# EAGLE design m220new (EAGLE 4.11)
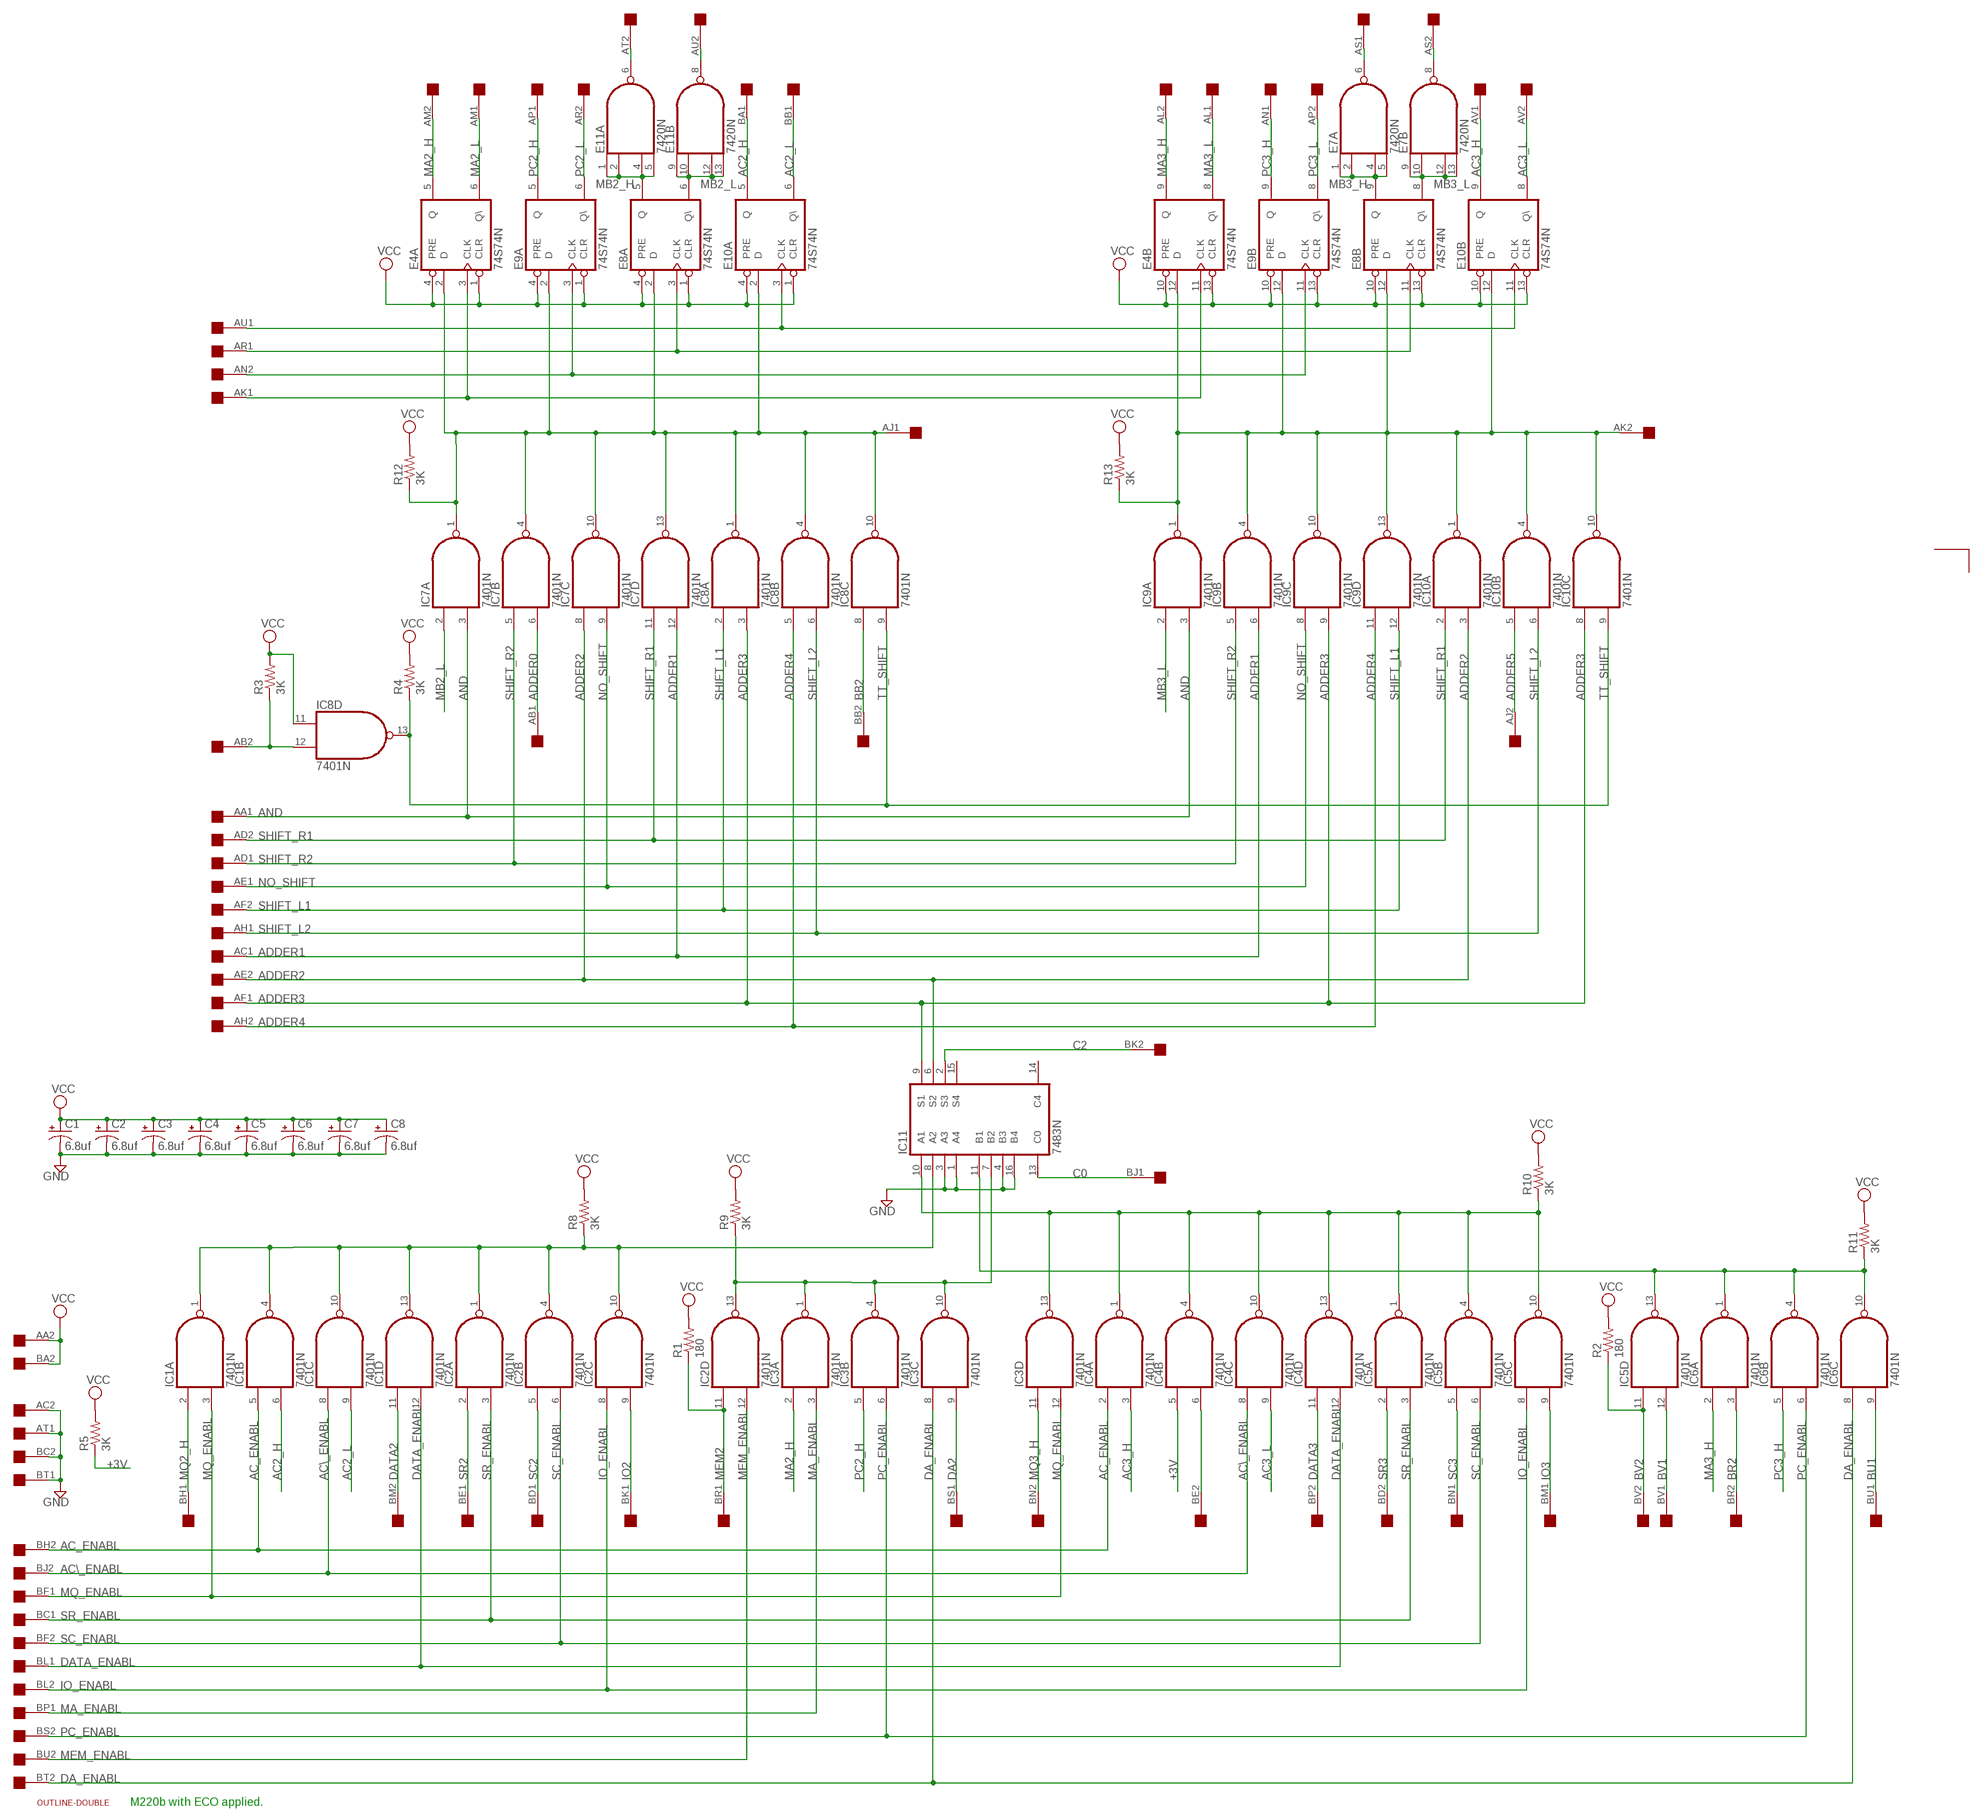
[diagram p0: schematic, sheet 1]

## Parts
C1  6.8uf  CPOL-USE15-5AXIAL  [E15-5]
C2  6.8uf  CPOL-USE15-5AXIAL  [E15-5]
C3  6.8uf  CPOL-USE15-5AXIAL  [E15-5]
C4  6.8uf  CPOL-USE15-5AXIAL  [E15-5]
C5  6.8uf  CPOL-USE15-5AXIAL  [E15-5]
C6  6.8uf  CPOL-USE15-5AXIAL  [E15-5]
C7  6.8uf  CPOL-USE15-5AXIAL  [E15-5]
C8  6.8uf  CPOL-USE15-5AXIAL  [E15-5]
E4  74S74N  [DIL14]
E7  7420N  74S20N  [DIL14]
E8  74S74N  [DIL14]
E9  74S74N  [DIL14]
E10  74S74N  [DIL14]
E11  7420N  74S20N  [DIL14]
IC1  7401N  [DIL14]
IC2  7401N  [DIL14]
IC3  7401N  [DIL14]
IC4  7401N  [DIL14]
IC5  7401N  [DIL14]
IC6  7401N  [DIL14]
IC7  7401N  [DIL14]
IC8  7401N  [DIL14]
IC9  7401N  [DIL14]
IC10  7401N  [DIL14]
IC11  7483N  [DIL16]
R1  180  R-US_0207/10  [0207/10]
R2  180  R-US_0207/10  [0207/10]
R3  3K  R-US_0207/10  [0207/10]
R4  3K  R-US_0207/10  [0207/10]
R5  3K  R-US_0207/10  [0207/10]
R8  3K  R-US_0207/10  [0207/10]
R9  3K  R-US_0207/10  [0207/10]
R10  3K  R-US_0207/10  [0207/10]
R11  3K  R-US_0207/10  [0207/10]
R12  3K  R-US_0207/10  [0207/10]
R13  3K  R-US_0207/10  [0207/10]
U$1  DOUBLE  [EDGE-CON4]
U$2  OUTLINE-DOUBLE  [DOUBLE]

## Nets
+3V: IC4.5(B:I0) R5.1
AC2_H: E10.5(A:Q) IC1.6(B:I1) U$1.BA1
AC2_L: E10.6(A:Q\) IC1.9(C:I1) U$1.BB1
AC3_H: E10.9(B:Q) IC4.3(A:I1) U$1.AV1
AC3_L: E10.8(B:Q\) IC4.9(C:I1) U$1.AV2
AC\_ENABL: IC1.8(C:I0) IC4.8(C:I0) U$1.BJ2
AC_ENABL: IC1.5(B:I0) IC4.2(A:I0) U$1.BH2
ADDER0: IC7.6(B:I1) U$1.AB1
ADDER1: IC7.12(D:I1) IC9.6(B:I1) U$1.AC1
ADDER2: IC7.8(C:I0) IC10.3(A:I1) IC11.6(S2) U$1.AE2
ADDER3: IC8.3(A:I1) IC9.9(C:I1) IC10.8(C:I0) IC11.9(S1) U$1.AF1
ADDER4: IC8.5(B:I0) IC9.11(D:I0) U$1.AH2
ADDER5: IC10.5(B:I0) U$1.AJ2
AJ1: E4.2(A:D) E8.2(A:D) E9.2(A:D) E10.2(A:D) IC7.1(A:O) IC7.4(B:O) IC7.10(C:O) IC7.13(D:O) IC8.1(A:O) IC8.4(B:O) IC8.10(C:O) R12.1 U$1.AJ1
AK1: E4.3(A:CLK) E4.11(B:CLK) U$1.AK1
AK2: E4.12(B:D) E8.12(B:D) E9.12(B:D) E10.12(B:D) IC9.1(A:O) IC9.4(B:O) IC9.10(C:O) IC9.13(D:O) IC10.1(A:O) IC10.4(B:O) IC10.10(C:O) R13.1 U$1.AK2
AN2: E9.3(A:CLK) E9.11(B:CLK) U$1.AN2
AND: IC7.3(A:I1) IC9.3(A:I1) U$1.AA1
AR1: E8.3(A:CLK) E8.11(B:CLK) U$1.AR1
AS1: E7.6(A:O) U$1.AS1
AS2: E7.8(B:O) U$1.AS2
AT2: E11.6(A:O) U$1.AT2
AU1: E10.3(A:CLK) E10.11(B:CLK) U$1.AU1
AU2: E11.8(B:O) U$1.AU2
BB2: IC8.8(C:I0) U$1.BB2
BE2: IC4.6(B:I1) U$1.BE2
BR2: IC6.3(A:I1) U$1.BR2
BU1: IC6.9(C:I1) U$1.BU1
BV1: IC5.12(D:I1) U$1.BV1
BV2: IC5.11(D:I0) R2.1 U$1.BV2
C0: IC11.13(C0) U$1.BJ1
C2: IC11.2(S3) U$1.BK2
DA2: IC3.9(C:I1) U$1.BS1
DA_ENABL: IC3.8(C:I0) IC6.8(C:I0) U$1.BT2
DATA2: IC1.11(D:I0) U$1.BM2
DATA3: IC4.11(D:I0) U$1.BP2
DATA_ENABL: IC1.12(D:I1) IC4.12(D:I1) U$1.BL1
GND: C1.- C2.- C3.- C4.- C5.- C6.- C7.- C8.- IC11.1(A4) IC11.3(A3) IC11.4(B3) IC11.16(B4) U$1.AC2 U$1.AT1 U$1.BC2 U$1.BT1
IO2: IC2.9(C:I1) U$1.BK1
IO3: IC5.9(C:I1) U$1.BM1
IO_ENABL: IC2.8(C:I0) IC5.8(C:I0) U$1.BL2
MA2_H: E4.5(A:Q) IC3.2(A:I0) U$1.AM2
MA2_L: E4.6(A:Q\) U$1.AM1
MA3_H: E4.9(B:Q) IC6.2(A:I0) U$1.AL2
MA3_L: E4.8(B:Q\) U$1.AL1
MA_ENABL: IC3.3(A:I1) U$1.BP1
MB2_H: E8.5(A:Q) E11.1(A:I0) E11.2(A:I1) E11.4(A:I2) E11.5(A:I3)
MB2_L: E8.6(A:Q\) E11.9(B:I0) E11.10(B:I1) E11.12(B:I2) E11.13(B:I3) IC7.2(A:I0)
MB3_H: E7.1(A:I0) E7.2(A:I1) E7.4(A:I2) E7.5(A:I3) E8.9(B:Q)
MB3_L: E7.9(B:I0) E7.10(B:I1) E7.12(B:I2) E7.13(B:I3) E8.8(B:Q\) IC9.2(A:I0)
MEM2: IC2.11(D:I0) R1.1 U$1.BR1
MEM_ENABL: IC2.12(D:I1) U$1.BU2
MQ2_H: IC1.2(A:I0) U$1.BH1
MQ3_H: IC3.11(D:I0) U$1.BN2
MQ_ENABL: IC1.3(A:I1) IC3.12(D:I1) U$1.BF1
N$5: IC1.1(A:O) IC1.4(B:O) IC1.10(C:O) IC1.13(D:O) IC2.1(A:O) IC2.4(B:O) IC2.10(C:O) IC11.8(A2) R8.1
N$8: IC3.13(D:O) IC4.1(A:O) IC4.4(B:O) IC4.10(C:O) IC4.13(D:O) IC5.1(A:O) IC5.4(B:O) IC5.10(C:O) IC11.10(A1) R10.1
N$12: IC2.13(D:O) IC3.1(A:O) IC3.4(B:O) IC3.10(C:O) IC11.7(B2) R9.1
N$14: IC5.13(D:O) IC6.1(A:O) IC6.4(B:O) IC6.10(C:O) IC11.11(B1) R11.1
NO_SHIFT: IC7.9(C:I1) IC9.8(C:I0) U$1.AE1
PC2_H: E9.5(A:Q) IC3.5(B:I0) U$1.AP1
PC2_L: E9.6(A:Q\) U$1.AR2
PC3_H: E9.9(B:Q) IC6.5(B:I0) U$1.AN1
PC3_L: E9.8(B:Q\) U$1.AP2
PC_ENABL: IC3.6(B:I1) IC6.6(B:I1) U$1.BS2
SC2: IC2.5(B:I0) U$1.BD1
SC3: IC5.5(B:I0) U$1.BN1
SC_ENABL: IC2.6(B:I1) IC5.6(B:I1) U$1.BF2
SHIFT_L1: IC8.2(A:I0) IC9.12(D:I1) U$1.AF2
SHIFT_L2: IC8.6(B:I1) IC10.6(B:I1) U$1.AH1
SHIFT_R1: IC7.11(D:I0) IC10.2(A:I0) U$1.AD2
SHIFT_R2: IC7.5(B:I0) IC9.5(B:I0) U$1.AD1
SR2: IC2.2(A:I0) U$1.BE1
SR3: IC5.2(A:I0) U$1.BD2
SR_ENABL: IC2.3(A:I1) IC5.3(A:I1) U$1.BC1
TT_SHIFT: IC8.9(C:I1) IC8.13(D:O) IC10.9(C:I1) R4.1
TT_SHIFT\: IC8.12(D:I1) R3.1 U$1.AB2
VCC: C1.+ C2.+ C3.+ C4.+ C5.+ C6.+ C7.+ C8.+ E4.1(A:CLR) E4.4(A:PRE) E4.10(B:PRE) E4.13(B:CLR) E8.1(A:CLR) E8.4(A:PRE) E8.10(B:PRE) E8.13(B:CLR) E9.1(A:CLR) E9.4(A:PRE) E9.10(B:PRE) E9.13(B:CLR) E10.1(A:CLR) E10.4(A:PRE) E10.10(B:PRE) E10.13(B:CLR) IC8.11(D:I0) R1.2 R2.2 R3.2 R4.2 R5.2 R8.2 R9.2 R10.2 R11.2 R12.2 R13.2 U$1.AA2 U$1.BA2
Unconnected: IC6.11(D:I0) IC6.12(D:I1) IC6.13(D:O) IC10.11(D:I0) IC10.12(D:I1) IC10.13(D:O) IC11.14(C4) IC11.15(S4)

## Notes on the sheet
- M220b with ECO applied.

## Power pins joined to a net without a drawn wire
GND: E4.7(P:GND) E7.7(P:GND) E8.7(P:GND) E9.7(P:GND) E10.7(P:GND) E11.7(P:GND) IC1.7(P:GND) IC2.7(P:GND) IC3.7(P:GND) IC4.7(P:GND) IC5.7(P:GND) IC6.7(P:GND) IC7.7(P:GND) IC8.7(P:GND) IC9.7(P:GND) IC10.7(P:GND) IC11.12(GND)
VCC: E4.14(P:VCC) E7.14(P:VCC) E8.14(P:VCC) E9.14(P:VCC) E10.14(P:VCC) E11.14(P:VCC) IC1.14(P:VCC) IC2.14(P:VCC) IC3.14(P:VCC) IC4.14(P:VCC) IC5.14(P:VCC) IC6.14(P:VCC) IC7.14(P:VCC) IC8.14(P:VCC) IC9.14(P:VCC) IC10.14(P:VCC) IC11.5(VCC)

## Library data of the parts
C1-C8 = rcl:CPOL-US: POLARIZED CAPACITOR, American symbol
E4 E8-E10 = 74xx-us:74*74: Dual D type positive edge triggered FLIP FLOP, preset and clear
E7 E11 = 74xx-jameco:74*20: Dual 4-input NAND gate
IC1-IC10 = 74xx-jameco:74*01: Quad 2-input NAND gate, open collector
IC11 = 74xx-jameco:74*83: 4-bit binary full ADDER, fast carry
R1-R5 R8-R13 = rcl:R-US_: RESISTOR, American symbol
U$1 = dec-con:DOUBLE: Double-Height DEC board
U$2 = dec-con:OUTLINE-*: Board outlines for DEC boards.

## Board
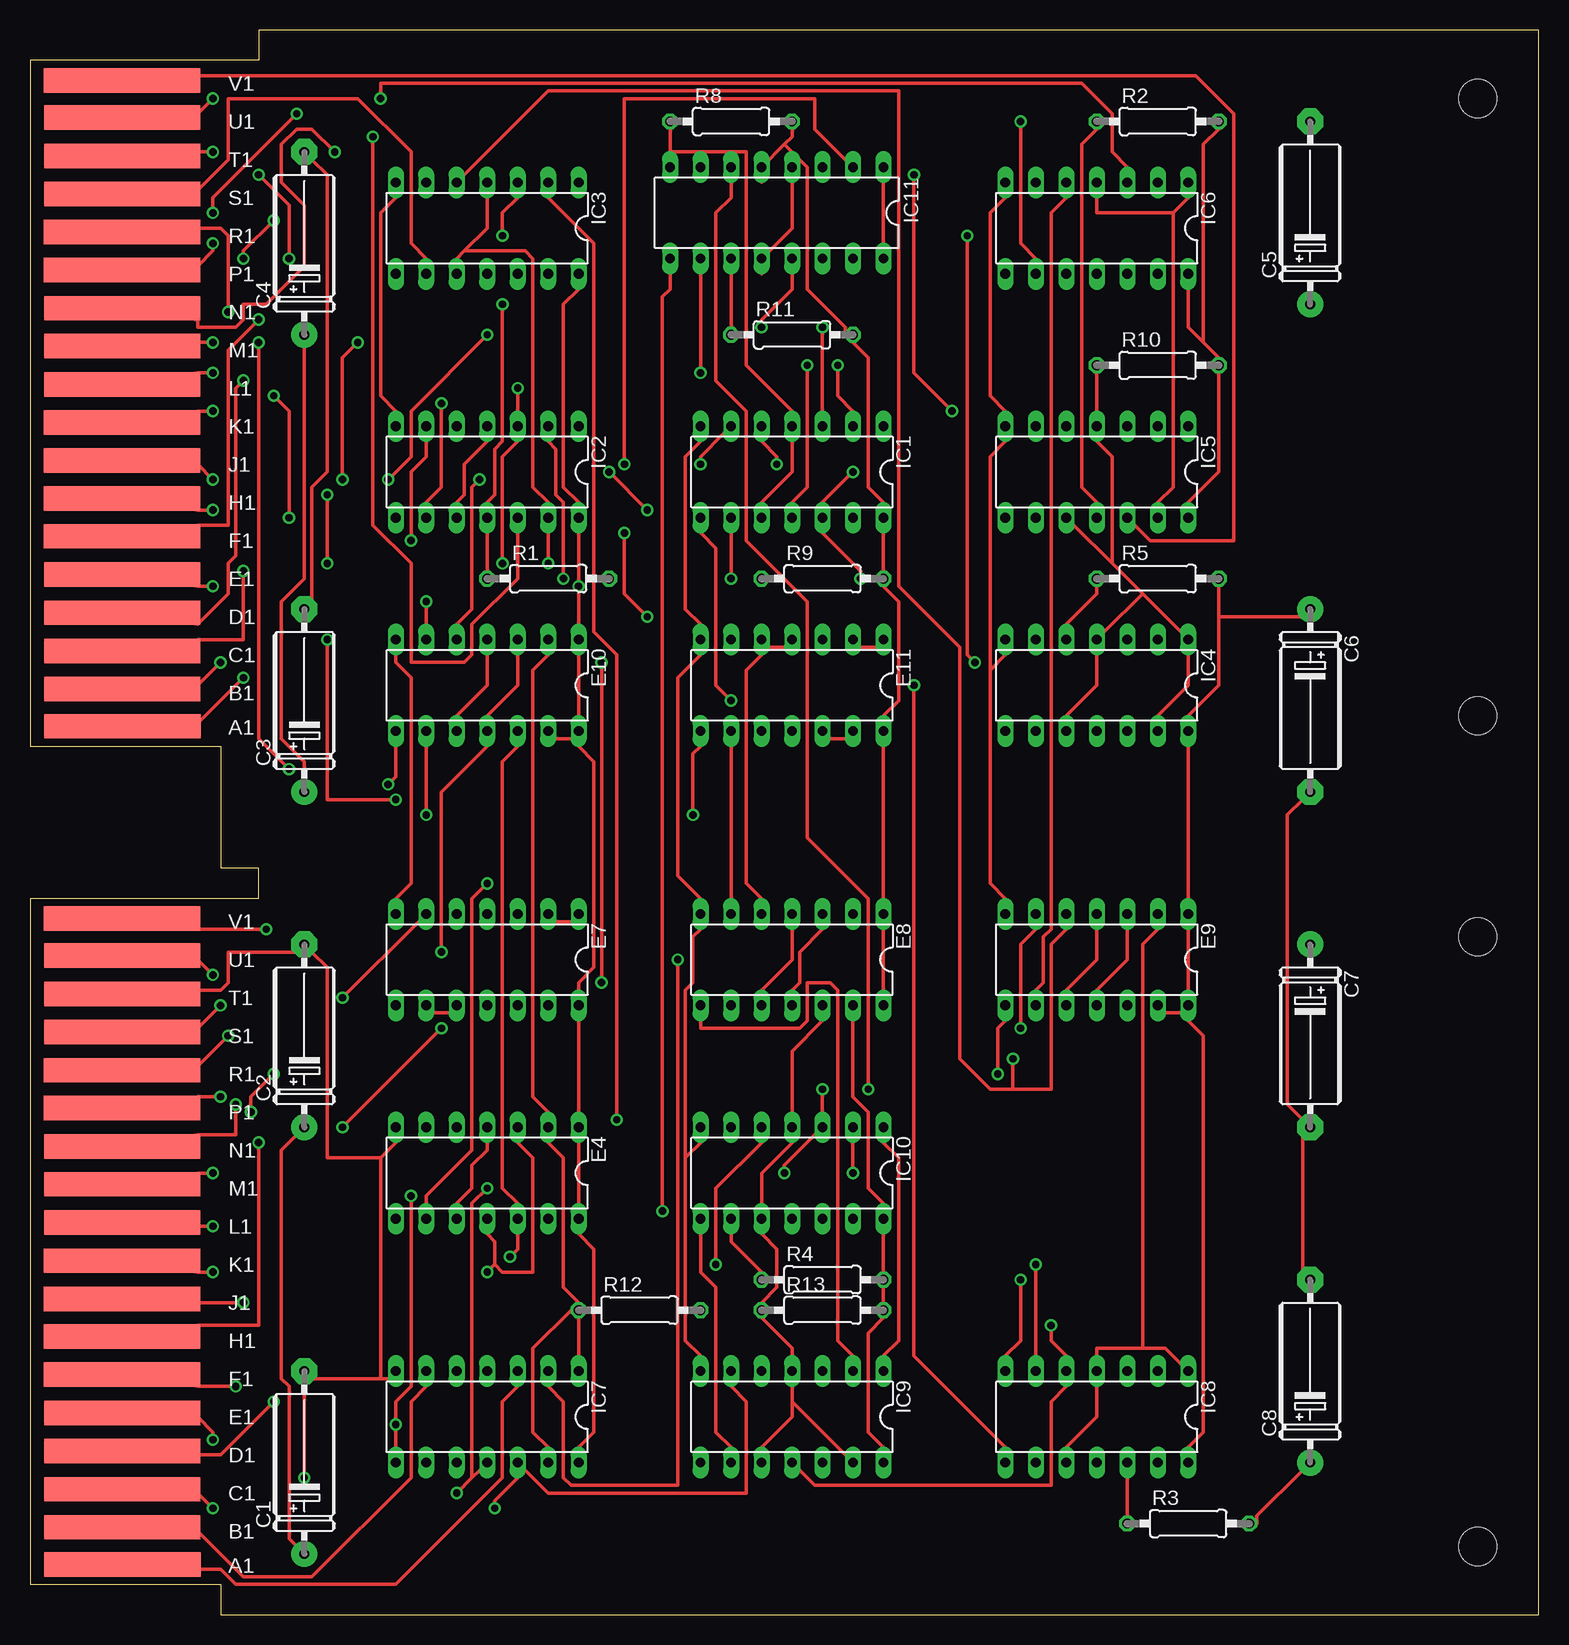
[diagram p1: board, top side]
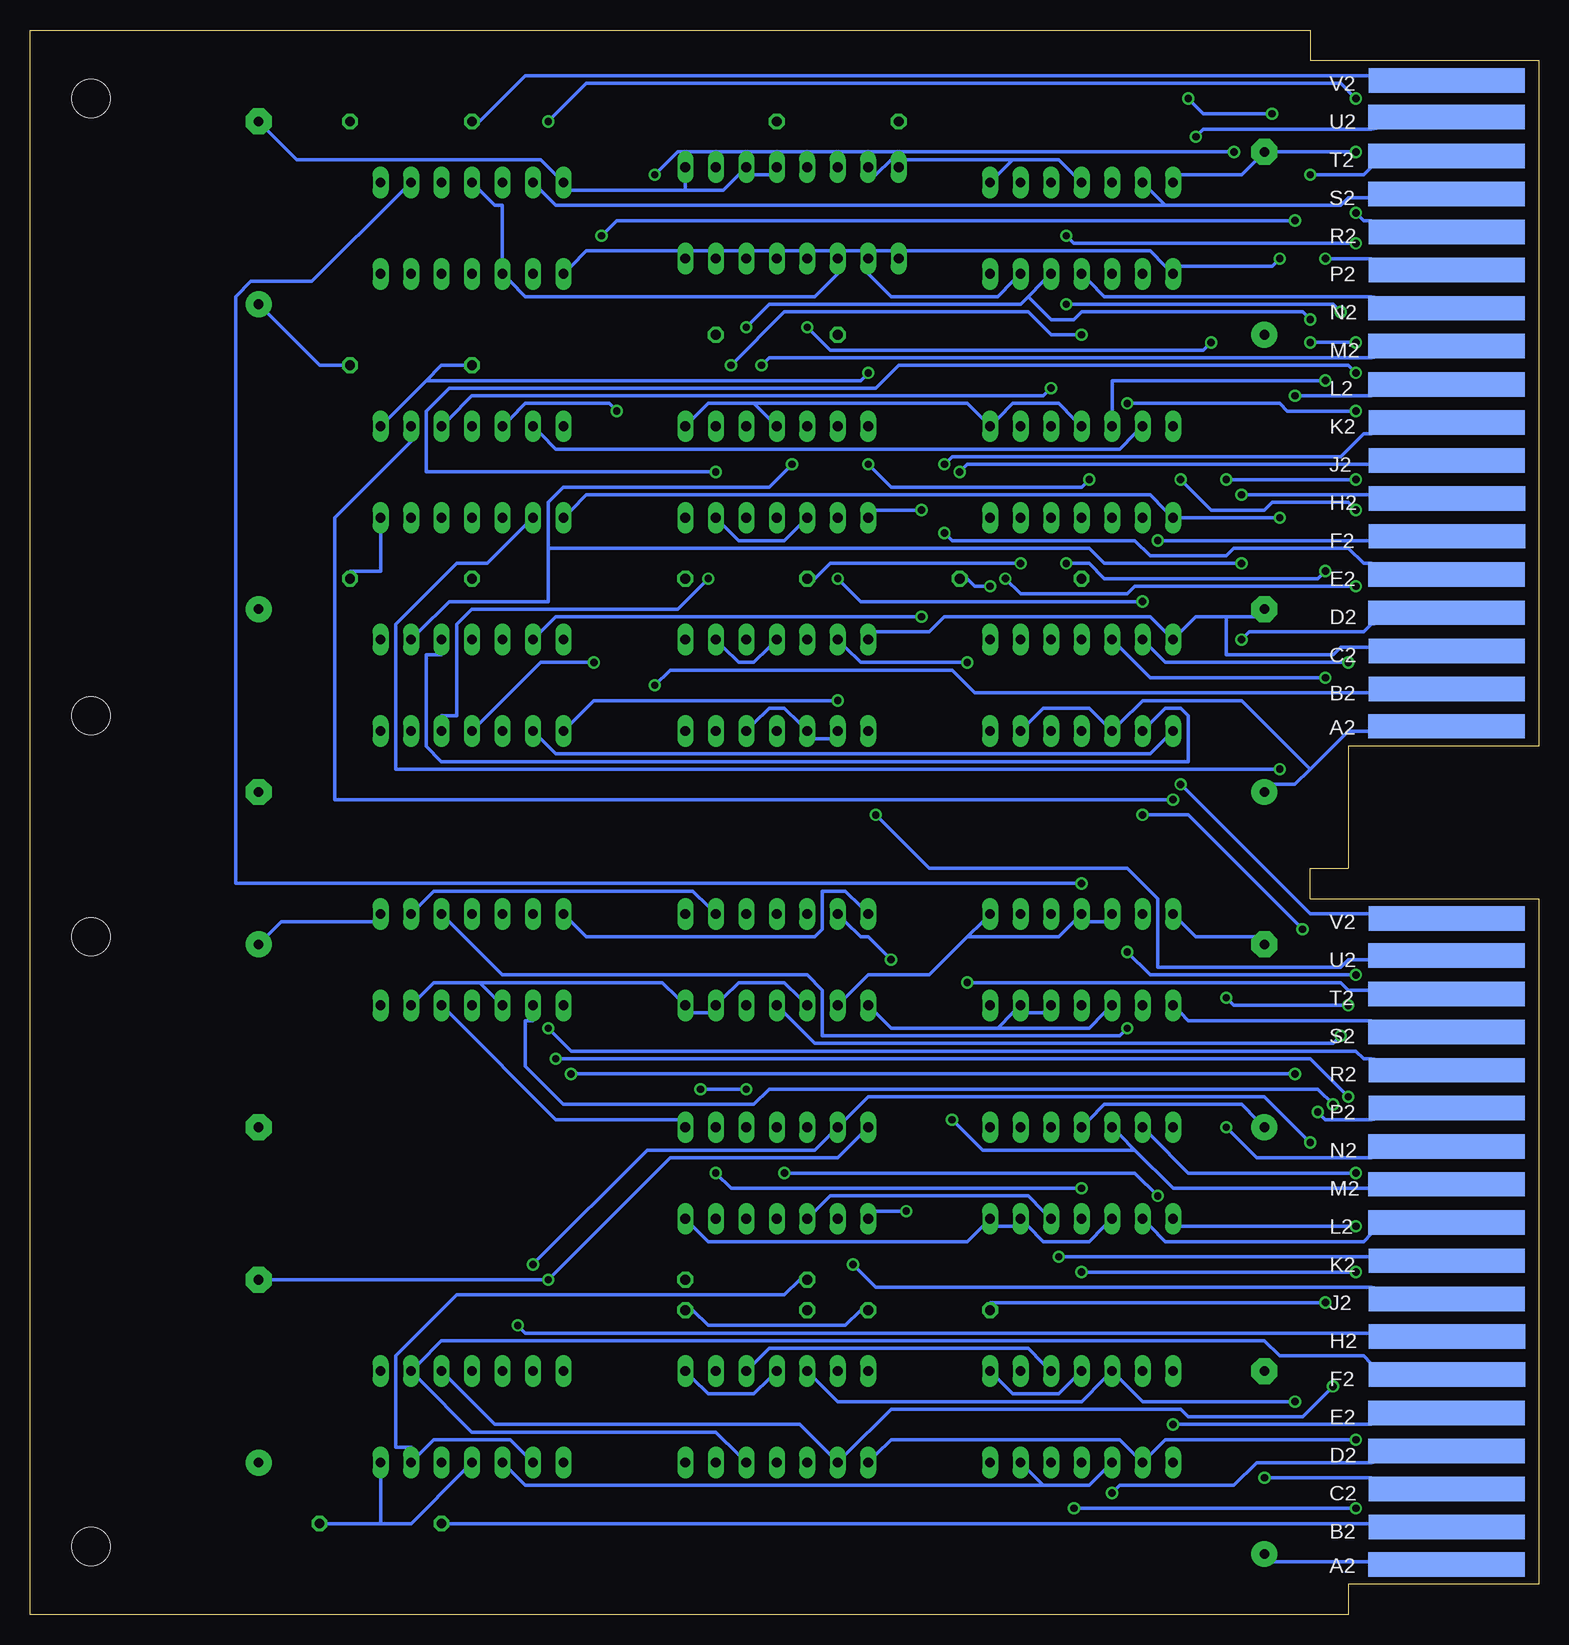
[diagram p2: board, bottom side, seen from below]

Size 125.73 x 132.08 mm. Coordinates in mm from the lower left corner, seen from the top.
Copper layers (1*16): Top 0.035mm / dielectric 1.5mm / Bottom 0.035mm
Design rules "olimex10mil": minimum track width 12mil, minimum drill 24mil, track to track 12mil, track to pad 12mil, pad to pad 12mil, via to via 12mil, smd to smd 10mil, copper to edge 25mil, drill to drill 10mil, minimum pad ring 10mil, minimum via ring 8mil, stop-mask expansion 0mil, vias tented up to drill 0mil, thermal gap 10mil

### Footprints (pad centres in the part's own frame; a part is rotated, then mirrored left to right if it is on the bottom)
E15-5 = drill 0.813 pad 2.159 round: + -7.62,0 | drill 0.813 pad 2.159 octagon: - 7.62,0
DIL14 = drill 0.813 long: 1 -7.62,-3.81; 2 -5.08,-3.81; 3 -2.54,-3.81; 4 0,-3.81; 5 2.54,-3.81; 6 5.08,-3.81; 7 7.62,-3.81; 8 7.62,3.81; 9 5.08,3.81; 10 2.54,3.81; 11 0,3.81; 12 -2.54,3.81; 13 -5.08,3.81; 14 -7.62,3.81
DIL16 = drill 0.813 long: 1 -8.89,-3.81; 2 -6.35,-3.81; 3 -3.81,-3.81; 4 -1.27,-3.81; 5 1.27,-3.81; 6 3.81,-3.81; 7 6.35,-3.81; 8 8.89,-3.81; 9 8.89,3.81; 10 6.35,3.81; 11 3.81,3.81; 12 1.27,3.81; 13 -1.27,3.81; 14 -3.81,3.81; 15 -6.35,3.81; 16 -8.89,3.81
0207/10 = drill 0.813 octagon: 1 -5.08,0; 2 5.08,0
EDGE-CON4 = smd 13.017 x 2.032: AA1 7.709,4.207; AB1 7.684,7.312; AC1 7.684,10.474; AD1 7.684,13.665; AE1 7.693,16.84; AF1 7.668,20.041; AH1 7.668,23.19; AJ1 7.668,26.34; AK1 7.668,29.515; AL1 7.693,32.69; AM1 7.693,35.89; AN1 7.693,39.04; AP1 7.668,42.24; AR1 7.668,45.39; AS1 7.693,48.565; AT1 7.693,51.74; AU1 7.693,54.94; AV1 7.668,58.026; BA1 7.709,74.057; BB1 7.684,77.162; BC1 7.684,80.324; BD1 7.684,83.515; BE1 7.693,86.69; BF1 7.668,89.891; BH1 7.668,93.04; BJ1 7.668,96.19; BK1 7.668,99.365; BL1 7.693,102.54; BM1 7.693,105.74; BN1 7.693,108.89; BP1 7.668,112.09; BR1 7.668,115.24; BS1 7.693,118.415; BT1 7.693,121.59; BU1 7.693,124.79; BV1 7.668,127.876 | smd 13.017 x 2.032 bottom: AA2 7.69,4.207; AB2 7.668,7.328; AC2 7.668,10.49; AD2 7.693,13.665; AE2 7.693,16.84; AF2 7.642,20.041; AH2 7.642,23.19; AJ2 7.668,26.34; AK2 7.668,29.515; AL2 7.693,32.69; AM2 7.693,35.89; AN2 7.693,39.04; AP2 7.668,42.24; AR2 7.668,45.39; AS2 7.693,48.565; AT2 7.693,51.74; AU2 7.693,54.966; AV2 7.668,58.026; BA2 7.69,74.057; BB2 7.668,77.178; BC2 7.668,80.34; BD2 7.693,83.515; BE2 7.693,86.69; BF2 7.642,89.891; BH2 7.642,93.04; BJ2 7.668,96.19; BK2 7.668,99.365; BL2 7.693,102.54; BM2 7.693,105.74; BN2 7.693,108.89; BP2 7.668,112.09; BR2 7.668,115.24; BS2 7.693,118.415; BT2 7.693,121.59; BU2 7.693,124.816; BV2 7.668,127.876
DOUBLE = hole 3.175: 120.65,56.515; 120.65,5.715; 120.65,74.93; 120.65,126.365

### Placement (x,y rotation side)
C1  22.86,12.7 90 top
C2  22.86,48.26 90 top
C3  22.86,76.2 90 top
C4  22.86,114.3 90 top
C5  106.68,116.84 90 top
C6  106.68,76.2 270 top
C7  106.68,48.26 270 top
C8  106.68,20.32 90 top
E4  38.1,36.83 180 top
E7  38.1,54.61 180 top
E8  63.5,54.61 180 top
E9  88.9,54.61 180 top
E10  38.1,77.47 180 top
E11  63.5,77.47 180 top
IC1  63.5,95.25 180 top
IC2  38.1,95.25 180 top
IC3  38.1,115.57 180 top
IC4  88.9,77.47 180 top
IC5  88.9,95.25 180 top
IC6  88.9,115.57 180 top
IC7  38.1,16.51 180 top
IC8  88.9,16.51 180 top
IC9  63.5,16.51 180 top
IC10  63.5,36.83 180 top
IC11  62.23,116.84 180 top
R1  43.18,86.36 0 top
R2  93.98,124.46 0 top
R3  96.52,7.62 0 top
R4  66.04,27.94 0 top
R5  93.98,86.36 0 top
R8  58.42,124.46 0 top
R9  66.04,86.36 0 top
R10  93.98,104.14 0 top
R11  63.5,106.68 0 top
R12  50.8,25.4 0 top
R13  66.04,25.4 0 top
U$1  0,0 0 top
U$2  0,0 0 top

### Tracks (layer width: path | path; a pad name or v marks a point on that pad's centre or on a via)
+3V
  Top 0.305: IC4.5 86.36,82.55 88.9,85.09 88.9,85.72 R5.1
AC2_H  (via drill 0.61)
  Top 0.305: v17.78,78.11 13.97,74.3 U$1.BA1 | v55.88,95.89 55.88,96.52 57.79,98.42 IC1.6 | v37.47,94.61 36.83,93.98 36.83,83.82 35.56,82.55 E10.5
  Bottom 0.305: v17.78,78.11 32.39,78.11 34.93,80.64 E10.5 | v55.88,95.89 53.98,93.98 38.1,93.98 v37.47,94.61
AC2_L  (via drill 0.61)
  Top 0.305: v15.88,79.38 13.97,77.47 U$1.BB1 | v58.42,86.36 58.42,90.17 IC1.9 | v33.02,84.45 33.02,82.55 E10.6
  Bottom 0.305: v15.88,79.38 31.12,79.38 32.39,80.64 E10.6 | v58.42,86.36 56.52,84.45 v33.02,84.45
AC3_H  (via drill 0.61)
  Top 0.305: v19.69,57.15 13.97,57.15 U$1.AV1 | v33.02,66.67 33.02,72.39 E10.9
  Bottom 0.305: E10.9 32.39,74.3 31.12,75.56 29.85,75.56 29.21,74.93 29.21,71.12 91.44,71.12 92.71,72.39 92.71,80.01 91.44,80.01 IC4.3 | v19.69,57.15 29.21,66.67 v33.02,66.67
AC3_L  (via drill 0.61)
  Top 0.305: v29.85,69.22 30.48,69.85 30.48,72.39 E10.8
  Bottom 0.305: E10.8 31.12,73.03 32.39,71.75 81.92,71.75 83.19,73.03 IC4.9 | v29.85,69.22 19.05,58.42 13.97,58.42 U$1.AV2
AC\_ENABL  (via drill 0.61)
  Top 0.305: v58.42,76.2 57.15,77.47 57.15,88.9 55.88,90.17 IC1.8 | v48.26,95.25 v51.44,92.08
  Bottom 0.305: v58.42,76.2 78.74,76.2 80.65,74.3 IC4.8 | v48.26,95.25 47.63,95.89 13.97,95.89 U$1.BJ2 | v51.44,92.08 55.25,92.08 IC1.8
AC_ENABL  (via drill 0.61)
  Top 0.305: v62.23,95.89 62.23,96.52 60.96,97.79 IC1.5 | v24.77,93.34 v24.77,87.63
  Bottom 0.305: v62.23,95.89 64.14,93.98 81.28,93.98 82.55,92.71 82.55,88.9 | 82.55,88.9 82.55,84.45 90.81,84.45 93.35,81.92 IC4.2 | v24.77,93.34 13.97,93.34 U$1.BH2 | v24.77,87.63 36.2,87.63 37.47,88.9 82.55,88.9
ADDER0
  Top 0.305: IC7.6 33.02,19.05 31.75,17.78 31.75,11.43 23.5,3.17 17.78,3.17 13.97,6.99 U$1.AB1
ADDER1  (via drill 0.61)
  Top 0.305: IC9.6 58.42,19.05 59.69,17.78 59.69,10.16 43.18,10.16 41.28,12.06 IC7.12 40.64,11.43 38.74,9.53 v38.74,8.89 | v15.24,8.89 13.97,10.16 U$1.AC1
  Bottom 0.305: v15.24,8.89 v38.74,8.89
ADDER2  (via drill 0.61)
  Top 0.305: IC7.8 30.48,13.97 v30.48,15.88 30.48,17.78 31.75,19.05 v31.75,34.92 | v62.87,36.83 62.87,37.47 65.41,40.01 IC10.3 66.04,41.91 v66.04,43.81 | v69.85,43.81 69.85,59.69 64.77,64.77 64.77,84.45 59.69,89.53 59.69,100.33 57.15,102.87 57.15,116.84 58.42,118.11 58.42,119.38 IC11.6
  Bottom 0.305: v30.48,15.88 13.97,15.88 U$1.AE2 | v62.87,36.83 33.66,36.83 v31.75,34.92 | v66.04,43.81 v69.85,43.81
ADDER3  (via drill 0.61)
  Top 0.305: IC9.9 58.42,13.97 57.15,15.24 57.15,27.3 55.88,28.57 55.88,31.75 IC10.8 | v52.71,33.66 52.71,109.86 53.34,110.49 53.34,111.76 IC11.9 | v17.15,19.05 13.97,19.05 U$1.AF1
  Bottom 0.305: IC8.3 90.81,19.68 87,15.88 61.6,15.88 59.06,13.34 IC9.9 57.79,13.34 53.98,17.14 29.85,17.14 29.21,16.51 19.69,16.51 v17.15,19.05 | v52.71,33.66 55.25,33.66 IC10.8
ADDER4  (via drill 0.61)
  Top 0.305: IC9.11 64.14,12.06 65.41,10.79 85.09,10.79 85.09,17.78 86.36,19.05 IC8.5 86.36,21.59 85.09,22.86 v85.09,24.13
  Bottom 0.305: v85.09,24.13 84.46,23.5 13.97,23.5 U$1.AH2
ADDER5  (via drill 0.61)
  Top 0.305: v57.15,29.21 57.15,35.56 60.96,39.37 IC10.5
  Bottom 0.305: v57.15,29.21 55.25,27.3 13.97,27.3 U$1.AJ2
AJ1  (via drill 0.61)
  Top 0.305: IC8.10 86.36,13.97 88.9,16.51 88.9,19.05 IC8.4 88.9,21.59 88.9,22.23 92.71,22.23 | 92.71,22.23 94.62,22.23 95.89,20.95 IC8.1 | 92.71,22.23 92.71,55.88 93.98,57.15 E9.2 | R12.1 45.72,24.77 45.72,21.59 IC7.1 | R12.1 45.72,26.04 44.45,27.3 44.45,38.1 43.18,39.37 E4.2 43.18,41.91 41.91,43.18 41.91,78.74 43.18,80.01 E10.2 | IC7.13 43.18,13.97 41.91,15.24 41.91,22.23 45.09,25.4 R12.1 | v17.78,26.04 13.97,26.04 U$1.AJ1
  Bottom 0.305: E8.2 69.22,59.05 70.49,60.33 92.08,60.33 93.35,59.05 E9.2 | 41.28,10.79 37.47,10.79 36.2,12.06 IC7.10 | 41.28,10.79 42.55,12.06 IC7.13 | IC7.4 38.74,19.68 40.01,18.41 43.82,18.41 45.09,19.68 IC7.1 | v17.78,26.04 45.72,26.04 R12.1 | 41.28,10.79 84.46,10.79 85.73,12.06 IC8.10
AK1  (via drill 0.61)
  Top 0.305: 38.74,29.21 38.74,31.11 38.1,31.75 E4.11 | 38.74,29.21 39.37,28.57 41.91,28.57 41.91,38.1 40.64,39.37 E4.3 | v38.1,28.57 38.74,29.21 | v15.24,28.57 13.97,28.57 U$1.AK1
  Bottom 0.305: v15.24,28.57 v38.1,28.57
AK2  (via drill 0.61)
  Top 0.305: 63.5,17.78 63.5,19.05 IC9.4 63.5,21.59 63.5,22.23 60.96,24.77 R13.1 60.96,26.04 62.23,27.3 62.23,30.48 60.96,31.75 IC10.10 60.96,34.29 60.96,36.83 63.5,39.37 IC10.4 63.5,41.91 63.5,46.99 66.04,49.53 E8.12 | 63.5,17.78 63.5,16.51 60.96,13.97 IC9.10 | 63.5,17.78 67.95,13.34 IC9.13 | IC10.1 71.12,39.37 72.39,38.1 72.39,22.86 71.12,21.59 IC9.1 | E10.12 40.64,72.39 39.37,71.12 39.37,35.56 40.64,34.29 E4.12 40.64,31.75 40.64,30.48 v40.01,29.84
  Bottom 0.305: IC9.1 70.49,19.68 69.22,18.41 65.41,18.41 64.14,19.68 IC9.4 | E9.12 90.81,50.16 81.92,41.27 71.76,41.27 IC10.1 | E4.12 41.28,33.66 42.55,34.92 59.06,34.92 60.33,33.66 IC10.10 | v40.01,29.84 13.97,29.84 U$1.AK2
AN2  (via drill 0.61)
  Top 0.305: E9.11 88.9,52.07 91.44,54.61 91.44,57.15 E9.3 | v26.04,40.64 v34.29,48.9
  Bottom 0.305: v34.29,48.9 34.93,48.26 59.69,48.26 59.69,52.07 60.96,53.34 86.36,53.34 90.81,57.78 E9.3 | v26.04,40.64 23.5,38.1 13.97,38.1 U$1.AN2
AND
  Top 0.305: IC7.3 40.64,19.05 39.37,17.78 39.37,11.43 30.48,2.54 17.15,2.54 15.88,3.81 13.97,3.81 U$1.AA1
  Bottom 0.305: IC7.3 41.28,20.95 42.55,22.23 64.14,22.23 65.41,20.95 IC9.3
AR1  (via drill 0.61)
  Top 0.305: E8.11 63.5,52.07 64.14,52.7 64.14,55.24 66.04,57.15 E8.3 | v16.51,48.26 13.97,45.72 U$1.AR1
  Bottom 0.305: v16.51,48.26 17.15,47.62 60.33,47.62 62.87,50.16 E8.11
AS1  (via drill 0.61)
  Top 0.305: v26.04,51.44 32.39,57.78 E7.6 | v15.88,50.8 13.97,48.9 U$1.AS1
  Bottom 0.305: v26.04,51.44 25.4,50.8 v15.88,50.8
AS2
  Bottom 0.305: E7.8 29.85,50.16 29.21,49.53 13.97,49.53 U$1.AS2
AT2  (via drill 0.61)
  Top 0.305: v47.63,52.7 v47.63,79.38
  Bottom 0.305: v47.63,79.38 56.52,79.38 57.79,80.64 E11.6 | v47.63,52.7 16.51,52.7 15.88,52.07 13.97,52.07 U$1.AT2
AU1  (via drill 0.61)
  Top 0.305: E10.3 40.64,80.01 40.64,77.47 38.1,74.93 E10.11 38.1,72.39 34.29,68.58 v34.29,55.24 | v15.24,53.34 13.97,54.61 U$1.AU1
  Bottom 0.305: v34.29,55.24 32.39,53.34 v15.24,53.34
AU2  (via drill 0.61)
  Top 0.305: v55.25,66.67 55.25,71.75 55.88,72.39 E11.8
  Bottom 0.305: v55.25,66.67 50.8,62.23 34.29,62.23 31.75,59.69 31.75,53.98 16.51,53.98 15.88,54.61 13.97,54.61 U$1.AU2
BB2  (via drill 0.61)
  Top 0.305: v73.66,77.47 73.66,21.59 81.28,13.97 IC8.8
  Bottom 0.305: v73.66,77.47 72.39,78.74 48.9,78.74 46.99,76.83 13.97,76.83 U$1.BB2
BE2  (via drill 0.61)
  Top 0.305: v51.44,83.19 49.53,85.09 v49.53,90.17
  Bottom 0.305: v51.44,83.19 81.92,83.19 83.19,81.92 IC4.6 | v49.53,90.17 48.9,89.53 33.66,89.53 32.39,88.27 26.04,88.27 25.4,88.9 15.88,88.9 14.61,87.63 13.97,87.63 U$1.BE2
BR2  (via drill 0.61)
  Top 0.305: v29.21,126.36 29.21,127.64 87.63,127.64 90.17,125.09 90.17,121.92 91.44,120.65 IC6.3 | v22.23,125.09 15.24,118.11 v15.24,116.84
  Bottom 0.305: v29.21,126.36 27.94,125.09 v22.23,125.09 | v15.24,116.84 14.61,116.2 13.97,116.2 U$1.BR2
BU1  (via drill 0.61)
  Top 0.305: v82.55,124.46 82.55,114.3 83.82,113.03 IC6.9 | v15.24,126.36 13.97,125.09 U$1.BU1
  Bottom 0.305: v82.55,124.46 79.38,127.64 16.51,127.64 v15.24,126.36
BV1
  Top 0.305: IC5.12 92.08,90.81 93.35,89.53 100.33,89.53 100.33,125.09 97.16,128.27 13.97,128.27 U$1.BV1
BV2
  Top 0.305: IC5.11 88.9,92.71 87.63,93.98 87.63,122.56 88.9,123.83 R2.1
  Bottom 0.305: U$1.BV2 13.97,128.27 84.46,128.27 88.27,124.46 R2.1
C0  (via drill 0.61)
  Top 0.305: v60.96,107.31 60.96,107.95 63.5,110.49 63.5,111.76 IC11.13 | v27.31,106.05 26.04,104.78 v26.04,94.61 | v15.24,94.61 13.97,95.89 U$1.BJ1
  Bottom 0.305: v60.96,107.31 59.06,105.41 27.94,105.41 v27.31,106.05 | v15.24,94.61 v26.04,94.61
C2  (via drill 0.61)
  Top 0.305: IC11.2 65.41,123.83 65.41,126.36 49.53,126.36 v49.53,95.89
  Bottom 0.305: v49.53,95.89 48.9,96.52 16.51,96.52 14.61,98.42 13.97,98.42 U$1.BK2
DA2
  Top 0.305: IC3.9 33.02,113.03 31.75,114.3 31.75,121.92 27.31,126.36 16.51,126.36 16.51,121.28 13.97,118.75 U$1.BS1
DA_ENABL  (via drill 0.61)
  Top 0.305: v19.05,120.02 21.59,117.47 v21.59,113.03
  Bottom 0.305: IC6.8 80.65,112.39 79.38,113.67 32.39,113.67 31.12,112.39 IC3.8 29.85,112.39 22.23,112.39 v21.59,113.03 | v19.05,120.02 14.61,120.02 13.97,120.65 U$1.BT2
DATA2  (via drill 0.61)
  Top 0.305: v64.77,104.14 64.77,93.98 63.5,92.71 IC1.11
  Bottom 0.305: v64.77,104.14 64.14,104.78 13.97,104.78 U$1.BM2
DATA3  (via drill 0.61)
  Top 0.305: v78.74,79.38 78.11,80.01 v78.11,114.94 | v20.32,116.2 17.78,113.67 v17.78,113.03
  Bottom 0.305: v78.74,79.38 83.19,79.38 88.27,74.3 IC4.11 | v78.11,114.94 76.84,116.2 v20.32,116.2 | v17.78,113.03 13.97,113.03 U$1.BP2
DATA_ENABL  (via drill 0.61)
  Top 0.305: v69.22,86.36 69.22,87 66.04,90.17 IC1.12 66.04,92.71 v68.58,95.25 | v15.24,103.5 13.97,103.5 U$1.BL1
  Bottom 0.305: v69.22,86.36 71.76,83.82 88.9,83.82 90.17,82.55 90.17,74.93 91.44,74.93 IC4.12 | v15.24,103.5 15.88,104.14 53.34,104.14 55.25,102.23 90.81,102.23 92.71,100.33 92.71,95.25 v68.58,95.25
GND  (via drill 0.61)
  Top 0.305: 80.01,78.74 80.01,60.96 81.28,59.69 E9.7 | 80.01,78.74 81.28,80.01 IC4.7 | 80.01,78.74 80.01,96.52 81.28,97.79 IC5.7 81.28,100.33 80.01,101.6 80.01,116.84 81.28,118.11 IC6.7 | 60.96,111.76 IC11.12 63.5,115.57 63.5,118.11 63.5,119.38 IC11.4 | 29.21,19.68 23.5,19.68 C1.- 22.86,19.68 v22.86,11.43 | 29.21,19.68 29.85,19.68 IC7.7 | 29.21,38.1 30.48,39.37 E4.7 | 29.21,19.68 29.21,38.1 | U$1.AT1 13.97,52.07 15.88,52.07 16.51,52.7 16.51,55.24 22.23,55.24 C2.- 23.5,55.24 24.77,53.98 24.77,38.1 29.21,38.1 | v82.55,27.94 82.55,22.86 81.28,21.59 IC8.7 | C8.- 106.05,28.57 106.05,40.01 C7.- 106.05,41.27 104.78,42.55 104.78,66.67 106.05,67.94 C6.- | IC2.7 30.48,100.33 29.21,101.6 29.21,116.84 30.48,118.11 IC3.7 | v15.24,121.92 13.97,121.92 U$1.BT1 | IC1.7 55.88,97.79 54.61,96.52 54.61,83.82 55.88,82.55 E11.7 55.88,80.01 53.98,78.11 53.98,61.59 55.88,59.69 E8.7 55.88,57.15 55.25,56.52 55.25,52.7 54.61,52.07 54.61,38.1 | 54.61,38.1 54.61,22.86 55.88,21.59 IC9.7 | 54.61,38.1 55.88,39.37 IC10.7 | C4.- 23.5,121.28 24.77,120.02 24.77,95.25 23.5,93.98 23.5,84.45 C3.- | E7.7 30.48,59.69 31.75,60.96 31.75,78.11 30.48,79.38 30.48,80.01 E10.7 | IC11.16 71.12,114.3 71.12,119.38 IC11.1
  Bottom 0.305: C5.- 106.05,123.83 103.51,121.28 83.19,121.28 81.92,120.02 IC6.7 80.65,118.75 71.76,118.75 71.12,118.75 | E7.7 29.85,57.78 28.58,56.52 23.5,56.52 C2.- | v22.86,11.43 13.97,11.43 U$1.AC2 | C8.- 106.05,27.94 v82.55,27.94 72.39,38.1 58.42,38.1 56.52,40.01 IC10.7 | IC3.7 29.85,120.02 24.77,120.02 23.5,121.28 C4.- 22.23,121.92 v15.24,121.92 | 26.04,83.19 23.5,83.19 C3.- | 26.04,83.19 28.58,83.19 29.85,81.92 E10.7 31.12,81.92 32.39,83.19 49.53,83.19 50.8,81.92 55.25,81.92 E11.7 | 26.04,83.19 26.04,80.01 17.15,80.01 16.51,80.64 13.97,80.64 U$1.BC2 | E9.7 80.65,57.78 79.38,56.52 60.33,56.52 59.69,57.15 59.69,60.33 57.79,60.33 56.52,59.05 E8.7 | IC11.4 64.14,120.02 65.41,120.02 IC11.3 66.68,120.02 67.95,118.75 71.12,118.75 | 71.12,118.75 71.12,119.38 IC11.1
IO2  (via drill 0.61)
  Top 0.305: v34.29,100.97 34.29,93.98 33.02,92.71 IC2.9 | v15.24,100.33 13.97,100.33 U$1.BK1
  Bottom 0.305: v34.29,100.97 21.59,100.97 20.96,100.33 v15.24,100.33
IO3  (via drill 0.61)
  Top 0.305: v21.59,70.48 19.05,73.03 v19.05,106.05 | v15.24,106.05 13.97,106.05 U$1.BM1
  Bottom 0.305: v21.59,70.48 95.25,70.48 95.25,82.55 90.17,87.63 87.63,87.63 84.46,90.81 IC5.9 | v19.05,106.05 v15.24,106.05
IO_ENABL  (via drill 0.61)
  Top 0.305: v20.32,101.6 21.59,100.33 v21.59,91.44
  Bottom 0.305: IC5.8 80.65,92.08 79.38,93.34 32.39,93.34 31.12,92.08 IC2.8 29.85,91.44 v21.59,91.44 | v20.32,101.6 13.97,101.6 U$1.BL2
MA2_H  (via drill 0.61)
  Top 0.305: v48.9,41.27 48.9,80.01 46.99,81.92 46.99,114.3 43.18,118.11 IC3.2
  Bottom 0.305: 33.66,38.73 30.48,35.56 13.97,35.56 U$1.AM2 | 33.66,38.73 34.93,40.01 E4.5 | v48.9,41.27 46.36,38.73 33.66,38.73
MA2_L  (via drill 0.61)
  Top 0.305: v15.24,36.83 13.97,36.83 U$1.AM1
  Bottom 0.305: v15.24,36.83 29.21,36.83 32.39,40.01 E4.6
MA3_H  (via drill 0.61)
  Top 0.305: v38.1,60.96 36.83,59.69 36.83,38.73 33.02,34.92 33.02,34.29 E4.9
  Bottom 0.305: E4.9 32.39,32.38 31.12,31.11 14.61,31.11 13.97,31.75 U$1.AL2 | v38.1,60.96 108.59,60.96 108.59,109.86 107.32,111.12 102.24,111.12 94.62,118.75 IC6.2
MA3_L  (via drill 0.61)
  Top 0.305: v15.24,32.38 13.97,32.38 U$1.AL1
  Bottom 0.305: v15.24,32.38 29.85,32.38 E4.8
MA_ENABL  (via drill 0.61)
  Top 0.305: v39.37,114.94 39.37,116.84 40.64,118.11 IC3.3 | v15.24,114.3 15.24,113.67 13.97,112.39 U$1.BP1
  Bottom 0.305: v39.37,114.94 38.74,114.3 v15.24,114.3
MB2_H
  Top 0.305: E11.2 69.22,80.64 70.49,80.64 E11.1 | E8.5 60.96,59.69 59.69,60.96 59.69,78.74 60.96,80.01 E11.5 61.6,80.64 62.87,80.64 E11.4
  Bottom 0.305: E11.2 67.95,80.64 66.68,79.38 65.41,79.38 64.14,80.64 E11.4
MB2_L  (via drill 0.61)
  Top 0.305: E11.12 66.68,73.03 67.95,73.03 E11.13 | v53.98,54.61 53.98,10.79 45.09,10.79 44.45,11.43 44.45,17.78 43.18,19.05 IC7.2 | E11.9 58.42,72.39 58.42,59.69 E8.6
  Bottom 0.305: E11.9 59.06,73.03 60.33,73.03 E11.10 61.6,74.3 62.87,75.56 64.14,75.56 65.41,74.3 E11.12 | v53.98,54.61 55.88,56.52 56.52,56.52 57.79,57.78 E8.6
MB3_H
  Top 0.305: E7.2 43.82,57.78 45.09,57.78 E7.1
  Bottom 0.305: E7.5 36.2,57.78 37.47,57.78 E7.4 38.74,57.78 40.01,56.52 47.63,56.52 | 47.63,56.52 46.36,57.78 E7.1 | 47.63,56.52 50.8,53.34 55.88,53.34 57.79,51.44 E8.9
MB3_L
  Top 0.305: E7.9 33.66,50.16 34.93,50.16 E7.10 | IC9.2 68.58,21.59 67.31,22.86 67.31,52.07 66.68,52.7 64.77,52.7 64.77,49.53 64.14,48.9 55.88,48.9 55.88,49.53 E8.8
  Bottom 0.305: E7.12 41.28,50.16 42.55,50.16 E7.13 43.82,50.16 45.09,48.9 | 45.09,48.9 53.98,48.9 55.25,50.16 E8.8 | 45.09,48.9 37.47,48.9 36.2,50.16 E7.10
MEM2  (via drill 0.61)
  Top 0.305: R1.1 38.1,87 38.1,90.17 IC2.11 38.1,92.71 38.74,93.34 38.74,97.16 39.37,97.79 v39.37,109.22 | v16.51,108.58 16.51,114.94 15.88,115.57 13.97,115.57 U$1.BR1
  Bottom 0.305: v39.37,109.22 17.15,109.22 v16.51,108.58
MEM_ENABL  (via drill 0.61)
  Top 0.305: v28.58,123.19 28.58,90.81 31.75,87.63 31.75,79.38 36.2,79.38 36.83,80.01 36.83,82.55 40.64,86.36 40.64,90.17 IC2.12
  Bottom 0.305: v28.58,123.19 27.94,123.83 13.97,123.83 U$1.BU2
MQ2_H  (via drill 0.61)
  Top 0.305: v67.31,104.14 67.31,101.6 68.58,100.33 IC1.2 | v38.1,106.68 31.75,100.33 31.75,96.52 v29.85,94.61 | v15.24,92.08 13.97,92.08 U$1.BH1
  Bottom 0.305: v67.31,104.14 62.87,108.58 42.55,108.58 40.64,106.68 v38.1,106.68 | v29.85,94.61 27.31,92.08 22.86,92.08 22.23,92.71 15.88,92.71 v15.24,92.08
MQ3_H
  Bottom 0.305: IC3.11 37.47,111.12 36.2,109.86 13.97,109.86 U$1.BN2
MQ_ENABL  (via drill 0.61)
  Top 0.305: v66.04,107.31 66.04,100.33 IC1.3 | v19.05,107.95 16.51,105.41 16.51,90.81 13.97,90.81 U$1.BF1
  Bottom 0.305: 42.55,109.86 43.18,109.22 64.14,109.22 v66.04,107.31 | 42.55,109.86 41.28,111.12 IC3.12 | v19.05,107.95 19.69,108.58 38.1,108.58 38.74,107.95 40.64,107.95 42.55,109.86
N$5
  Top 0.305: IC2.10 35.56,92.71 36.2,93.34 36.2,95.89 38.1,97.79 IC2.4 | 53.34,121.92 53.34,123.83 R8.1 | 53.34,121.92 IC11.8 | IC1.10 60.96,92.71 63.5,95.25 63.5,97.79 IC1.4 63.5,100.33 59.69,104.14 59.69,121.92 53.34,121.92
  Bottom 0.305: IC2.4 38.74,99.69 40.01,100.97 43.82,100.97 45.09,99.69 IC2.1 46.36,99.69 47.63,100.97 65.41,100.97 | IC1.13 67.95,90.81 66.68,89.53 62.87,89.53 61.6,90.81 IC1.10 | 65.41,100.97 69.22,100.97 70.49,99.69 IC1.1 | 65.41,100.97 64.14,99.69 IC1.4
N$8  (via drill 0.61)
  Top 0.305: R10.1 88.9,103.5 88.9,100.33 IC5.4 88.9,97.79 90.17,96.52 90.17,87.63 | IC4.10 86.36,74.93 88.9,77.47 88.9,80.01 IC4.4 89.54,81.92 92.71,85.09 | 92.71,85.09 95.89,81.92 IC4.1 96.52,80.01 96.52,77.47 93.98,74.93 IC4.13 | 90.17,87.63 92.71,85.09 | 90.17,87.63 87,90.81 IC5.10 | v55.88,103.5 55.88,110.49 55.88,111.76 IC11.10
  Bottom 0.305: IC3.13 43.82,111.12 45.09,109.86 53.98,109.86 55.25,111.12 55.88,111.76 IC11.10 | 92.71,102.87 91.44,104.14 89.54,104.14 R10.1 | 92.71,102.87 95.89,99.69 IC5.1 | v55.88,103.5 56.52,102.87 92.71,102.87
N$12  (via drill 0.61)
  Top 0.305: 36.2,113.67 38.1,115.57 38.1,118.11 IC3.4 | 36.2,113.67 35.56,113.03 IC3.10 | 36.2,113.67 41.28,113.67 41.91,113.03 41.91,93.98 43.18,92.71 IC2.13 43.18,90.17 v43.18,87.63
  Bottom 0.305: 43.82,121.28 45.09,120.02 IC3.1 | 43.82,121.28 40.01,121.28 38.74,120.02 IC3.4 | 43.82,121.28 53.98,121.28 55.25,120.02 IC11.7 | v43.18,87.63 59.06,87.63 60.33,86.36 R9.1
N$14
  Top 0.305: 95.25,116.84 95.25,93.98 93.98,92.71 IC5.13 | 95.25,116.84 96.52,118.11 IC6.1 | R11.1 58.42,107.31 58.42,110.49 58.42,111.76 IC11.11 | 95.25,116.84 88.9,116.84 88.9,118.11 IC6.4
  Bottom 0.305: IC6.4 88.27,118.75 87,117.47 86.36,117.47 86.36,113.03 IC6.10 85.73,111.12 84.46,109.86 60.33,109.86 59.06,111.12 58.42,111.76 IC11.11
NO_SHIFT  (via drill 0.61)
  Top 0.305: v15.24,14.61 15.24,15.24 13.97,16.51 U$1.AE1
  Bottom 0.305: IC9.8 55.25,13.34 53.98,14.61 34.93,14.61 33.66,13.34 IC7.9 32.39,13.34 31.12,14.61 v15.24,14.61
PC2_H  (via drill 0.61)
  Top 0.305: 81.92,43.81 85.09,43.81 85.09,55.88 86.36,57.15 E9.5 | 81.92,43.81 80.01,43.81 77.47,46.35 77.47,80.64 72.39,85.72 72.39,127 43.18,127 36.2,120.02 IC3.5 | v15.88,43.18 13.97,43.18 U$1.AP1 | v81.92,46.35 81.92,43.81
  Bottom 0.305: v15.88,43.18 19.05,46.35 v81.92,46.35
PC2_L  (via drill 0.61)
  Top 0.305: v82.55,48.9 82.55,55.88 83.82,57.15 E9.6
  Bottom 0.305: v82.55,48.9 80.65,46.99 15.24,46.99 14.61,46.35 13.97,46.35 U$1.AR2
PC3_H  (via drill 0.61)
  Top 0.305: E9.9 83.82,52.07 84.46,52.7 84.46,56.52 85.09,57.15 85.09,116.84 86.36,118.11 IC6.5 | v17.15,42.55 17.15,40.01 13.97,40.01 U$1.AN1
  Bottom 0.305: v17.15,42.55 18.42,43.81 64.14,43.81 65.41,42.55 81.28,42.55 84.46,45.72 84.46,49.53 83.82,49.53 E9.9
PC3_L  (via drill 0.61)
  Top 0.305: v80.65,45.09 80.65,48.9 81.28,49.53 E9.8 | v20.32,45.09 18.42,43.18 v18.42,41.91
  Bottom 0.305: v20.32,45.09 v80.65,45.09 | v18.42,41.91 17.78,41.27 13.97,41.27 U$1.AP2
PC_ENABL
  Bottom 0.305: 31.12,117.47 32.39,118.75 IC3.6 | 31.12,117.47 16.51,117.47 15.88,118.11 13.97,118.11 U$1.BS2 | 31.12,117.47 81.92,117.47 83.19,118.75 IC6.6
SC2  (via drill 0.61)
  Top 0.305: v17.78,102.87 17.15,102.23 17.15,88.27 16.51,87.63 16.51,85.09 13.97,82.55 U$1.BD1
  Bottom 0.305: v17.78,102.87 35.56,102.87 35.56,100.33 IC2.5
SC3  (via drill 0.61)
  Top 0.305: v76.84,100.33 73.66,103.5 v73.66,120.02 | v25.4,121.92 23.5,123.83 22.23,123.83 20.96,122.56 20.96,119.38 22.86,117.47 22.86,112.39 19.69,109.22 17.78,109.22 17.78,107.95 17.15,107.31 13.97,107.31 13.97,107.95 U$1.BN1
  Bottom 0.305: v76.84,100.33 77.47,100.97 84.46,100.97 85.73,99.69 IC5.5 | v73.66,120.02 71.76,121.92 v25.4,121.92
SC_ENABL  (via drill 0.61)
  Top 0.305: v31.75,89.53 31.75,95.25 33.02,96.52 33.02,97.79 IC2.6
  Bottom 0.305: IC2.6 33.66,98.42 34.93,97.16 81.92,97.16 83.19,98.42 IC5.6 | v31.75,89.53 13.97,89.53 U$1.BF2
SHIFT_L1
  Bottom 0.305: IC9.12 66.68,13.34 68.58,15.24 88.9,15.24 93.35,19.68 IC8.2 93.35,20.95 91.44,22.86 22.86,22.86 21.59,21.59 14.61,21.59 13.97,20.95 U$1.AF2
SHIFT_L2  (via drill 0.61)
  Top 0.305: v83.82,29.21 83.82,21.59 IC8.6 | v19.05,39.37 19.05,24.13 13.97,24.13 U$1.AH1
  Bottom 0.305: v83.82,29.21 74.3,38.73 60.33,38.73 59.06,40.01 IC10.6 57.79,41.27 55.88,43.18 22.86,43.18 v19.05,39.37
SHIFT_R1  (via drill 0.61)
  Top 0.305: v35.56,10.16 36.83,11.43 | 36.83,11.43 37.47,12.06 IC7.11 | v68.58,36.83 68.58,39.37 IC10.2 | v38.1,35.56 36.83,34.29 36.83,11.43
  Bottom 0.305: v35.56,10.16 34.93,10.79 25.4,10.79 23.5,12.7 13.97,12.7 U$1.AD2 | v68.58,36.83 67.31,35.56 v38.1,35.56
SHIFT_R2  (via drill 0.61)
  Top 0.305: v20.32,17.78 15.88,13.34 13.97,13.34 U$1.AD1
  Bottom 0.305: IC9.5 60.33,19.68 58.42,17.78 38.1,17.78 36.2,19.68 IC7.5 34.93,19.68 33.02,17.78 v20.32,17.78
SR2  (via drill 0.61)
  Top 0.305: v44.45,86.36 44.45,92.71 43.82,93.34 43.82,97.16 43.18,97.79 IC2.2 | v15.24,85.72 13.97,85.72 U$1.BE1
  Bottom 0.305: v44.45,86.36 43.18,85.09 34.29,85.09 33.66,85.72 v15.24,85.72
SR3  (via drill 0.61)
  Top 0.305: v30.48,67.94 24.77,67.94 v24.77,81.28
  Bottom 0.305: v30.48,67.94 100.33,67.94 100.33,91.44 93.98,97.79 IC5.2 | v24.77,81.28 24.13,81.92 14.61,81.92 13.97,82.55 U$1.BD2
SR_ENABL  (via drill 0.61)
  Top 0.305: v40.64,102.23 40.64,100.33 IC2.3 40.64,97.79 39.37,96.52 v39.37,87.63 | v17.78,87 17.78,81.28 13.97,81.28 U$1.BC1
  Bottom 0.305: v40.64,102.23 41.28,101.6 88.9,101.6 90.81,99.69 IC5.3 | v17.78,87 18.42,86.36 36.2,86.36 37.47,87.63 v39.37,87.63
TT_SHIFT
  Top 0.305: R4.1 60.96,28.57 58.42,31.11 58.42,31.75 IC10.9
  Bottom 0.305: IC8.9 84.46,13.34 85.73,14.61 92.08,14.61 93.35,13.34 IC8.13 93.98,13.97 95.25,13.97 95.25,21.59 90.17,26.67 62.87,26.67 61.6,27.94 R4.1
TT_SHIFT\
  Top 0.305: R3.1 91.44,8.26 91.44,11.43 IC8.12
  Bottom 0.305: R3.1 90.81,7.62 13.97,7.62 U$1.AB2
VCC  (via drill 0.61)
  Top 0.305: E10.10 35.56,74.93 38.1,77.47 38.1,80.01 E10.4 | E10.13 43.82,73.03 45.09,73.03 E10.14 | E10.14 45.72,74.93 45.72,80.01 E10.1 45.72,82.55 v45.72,85.72 45.72,90.17 IC2.14 45.72,92.71 44.45,93.98 44.45,109.22 45.72,110.49 IC3.14 | C4.+ 22.86,106.05 22.86,86.36 20.96,84.45 20.96,73.03 22.86,71.12 22.86,69.22 C3.+ | E4.10 35.56,34.29 36.83,35.56 36.83,37.47 38.1,38.73 38.1,39.37 E4.4 | IC7.14 45.72,13.97 46.99,15.24 46.99,30.48 45.72,31.75 E4.14 45.72,34.29 45.72,39.37 E4.1 45.72,41.91 45.72,49.53 E7.14 45.72,52.07 45.72,52.7 46.99,53.98 46.99,71.12 45.72,72.39 E10.14 | C1.+ 22.23,5.71 21.59,6.35 21.59,19.05 20.96,19.68 20.96,38.73 22.23,40.01 C2.+ | 99.06,83.19 99.06,85.72 R5.2 | 99.06,83.19 99.06,77.47 96.52,74.93 IC4.14 96.52,72.39 96.52,59.69 E9.1 96.52,57.15 96.52,52.07 E9.14 | 99.06,83.19 106.05,83.19 C6.+ | 97.79,106.05 96.52,107.31 96.52,110.49 IC6.14 | 97.79,106.05 99.06,104.78 R10.2 99.06,103.5 99.06,95.25 96.52,92.71 IC5.14 | 97.79,106.05 97.79,122.56 99.06,123.83 R2.2 | 62.87,122.56 63.5,123.19 63.5,123.83 R8.2 | 62.87,122.56 IC11.5 60.96,119.38 | 62.87,122.56 64.77,120.65 64.77,110.49 67.95,107.31 67.95,106.68 R11.2 68.58,106.05 69.85,104.78 69.85,93.98 71.12,92.71 IC1.14 71.12,90.17 71.12,87 R9.2 71.12,85.72 72.39,84.45 72.39,76.2 71.12,74.93 E11.14 71.12,72.39 71.12,59.69 E8.1 71.12,57.15 71.12,52.07 E8.14 | IC9.14 71.12,13.97 69.85,15.24 69.85,23.5 71.12,24.77 R13.2 71.12,26.04 71.12,27.3 R4.2 71.12,28.57 71.12,31.75 IC10.14 71.12,34.29 69.85,35.56 69.85,41.91 68.58,43.18 68.58,49.53 E8.13 | E8.10 60.96,52.07 63.5,54.61 63.5,57.15 E8.4
  Top 0.305: C8.+ 106.05,12.06 102.24,8.26 102.24,7.62 R3.2 | E9.10 86.36,52.07 88.9,54.61 88.9,57.15 E9.4 | E9.13 94.62,50.16 95.89,50.16 E9.14 | IC8.14 96.52,13.97 97.79,15.24 97.79,48.26 96.52,49.53 E9.14
  Bottom 0.305: v45.72,85.72 46.99,85.72 47.63,86.36 R1.2 | E10.13 42.55,74.3 41.28,75.56 37.47,75.56 36.2,74.3 E10.10 34.93,74.3 33.02,76.2 24.77,76.2 19.05,70.48 | 19.05,70.48 15.88,73.66 13.97,73.66 U$1.BA2 | 19.05,70.48 20.32,69.22 22.23,69.22 C3.+ | C1.+ 22.23,4.45 13.97,4.45 U$1.AA2 | C2.+ 23.5,41.27 24.77,42.55 36.2,42.55 37.47,41.27 E4.4 | E4.10 36.2,32.38 37.47,31.11 41.28,31.11 42.55,32.38 E4.13 43.82,32.38 45.09,32.38 E4.14 46.36,32.38 47.63,31.11 69.22,31.11 70.49,32.38 IC10.14 | IC5.14 96.52,90.17 96.52,87 99.06,87 R5.2 | C5.+ 106.05,108.58 101.6,104.14 99.7,104.14 R10.2 | R12.2 56.52,25.4 57.79,24.13 69.22,24.13 70.49,25.4 R13.2 | E8.10 61.6,51.44 62.87,52.7 66.68,52.7 67.95,51.44 E8.13 69.22,50.16 70.49,50.16 E8.14 71.76,51.44 73.03,52.7 88.27,52.7 | 96.52,7.62 100.97,7.62 R3.2 | 96.52,7.62 93.98,7.62 89.54,12.06 IC8.11 | 96.52,7.62 96.52,11.43 IC8.14 | C7.+ 106.05,56.52 104.78,57.78 97.16,57.78 E9.1 | 88.27,52.7 87,51.44 E9.10 | 88.27,52.7 92.08,52.7 93.35,51.44 E9.13